# Altium schematic sheet Signal_Acquisition.SchDoc
size A4
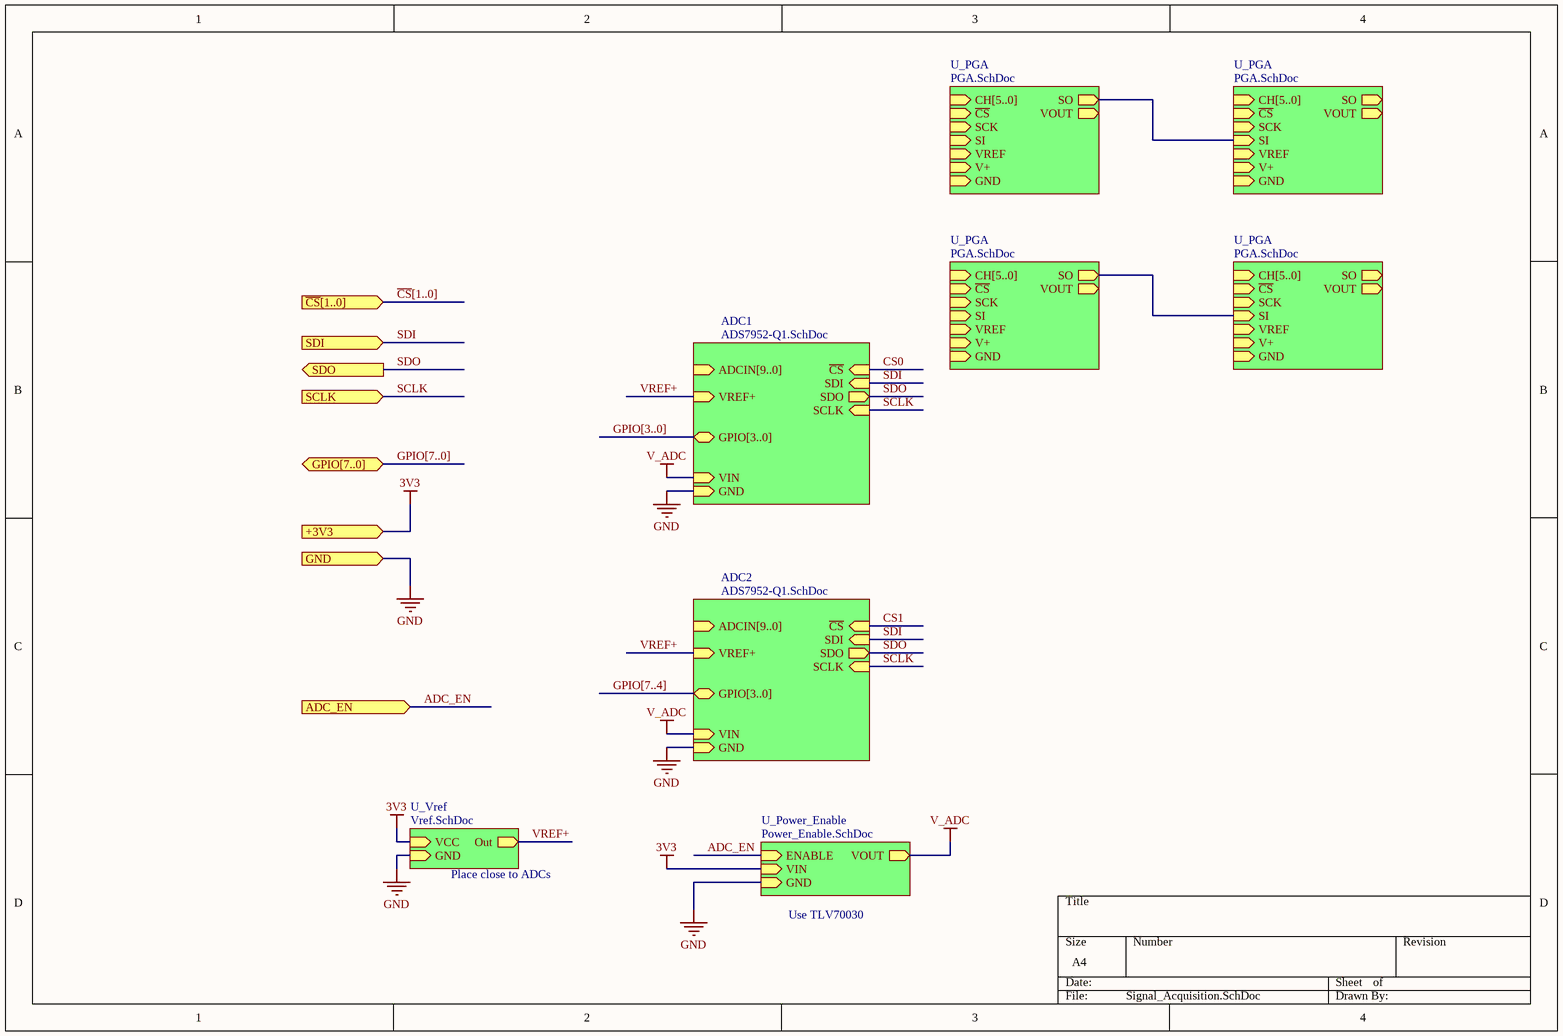
[diagram p0: Signal_Acquisition.SchDoc]

## Sub-sheets
ADC1 = ADS7952-Q1.SchDoc: SDO (out), SDI (in), GPIO[3..0] (bidir), GND (in), VREF+ (in), SCLK (in), ~{CS} (in), ADCIN[9..0] (in), VIN (in)
ADC2 = ADS7952-Q1.SchDoc: SDO (out), SDI (in), GPIO[3..0] (bidir), GND (in), VREF+ (in), SCLK (in), ~{CS} (in), ADCIN[9..0] (in), VIN (in)
U_PGA = PGA.SchDoc: CH[5..0] (in), SO (out), ~{CS} (in), SCK (in), SI (in), VOUT (out), VREF (in), V+ (in), GND (in)
U_PGA = PGA.SchDoc: CH[5..0] (in), SO (out), ~{CS} (in), SCK (in), SI (in), VOUT (out), VREF (in), V+ (in), GND (in)
U_PGA = PGA.SchDoc: CH[5..0] (in), SO (out), ~{CS} (in), SCK (in), SI (in), VOUT (out), VREF (in), V+ (in), GND (in)
U_PGA = PGA.SchDoc: CH[5..0] (in), SO (out), ~{CS} (in), SCK (in), SI (in), VOUT (out), VREF (in), V+ (in), GND (in)
U_Power_Enable = Power_Enable.SchDoc: ENABLE (in), VIN (in), VOUT (out), GND (in)
U_Vref = Vref.SchDoc: Out (out), VCC (in), GND (in)

## Ports
+3V3 (in), ADC_EN (in), GND (in), GPIO[7..0], SCLK (in), SDI (in), SDO (out), ~{CS}[1..0] (in)

## Nets
3V3: port +3V3, sheet U_Vref/VCC, sheet U_Power_Enable/VIN
GND: port GND, sheet ADC1/GND, sheet ADC2/GND, sheet U_Vref/GND, sheet U_Power_Enable/GND
V_ADC: sheet ADC1/VIN, sheet ADC2/VIN, sheet U_Power_Enable/VOUT
ADC_EN: port ADC_EN, sheet U_Power_Enable/ENABLE
CS0: sheet ADC1/~{CS}
CS1: sheet ADC2/~{CS}
SCLK: port SCLK, sheet ADC1/SCLK, sheet ADC2/SCLK
SDI: port SDI, sheet ADC1/SDI, sheet ADC2/SDI
SDO: port SDO, sheet ADC1/SDO, sheet ADC2/SDO
VREF+: sheet ADC1/VREF+, sheet ADC2/VREF+, sheet U_Vref/Out
(unnamed): sheet U_PGA/SO, sheet U_PGA/SI
(unnamed): sheet U_PGA/SO, sheet U_PGA/SI

## Buses and harness runs
bus GPIO[3..0] = sheet ADC1/GPIO[3..0]
bus GPIO[7..0] = port GPIO[7..0]
bus GPIO[7..4] = sheet ADC2/GPIO[3..0]
bus ~{CS}[1..0] = port ~{CS}[1..0]

## Notes on the sheet
- Place close to ADCs
- Use TLV70030